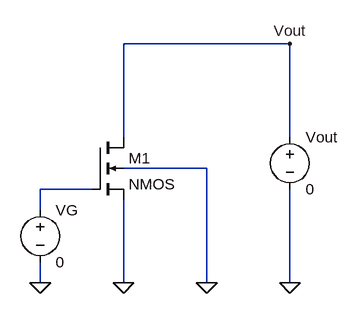
[diagram p0: schematic Chapter03C_01.fig.asc]
Chapter03C_01.fig.asc, the LTspice schematic file:
Version 4
SHEET 1 2940 740
WIRE 112 -64 -144 -64
WIRE -144 80 -144 -64
WIRE 112 80 112 -64
WIRE -16 128 -144 128
WIRE -192 160 -272 160
WIRE -272 192 -272 160
WIRE -272 304 -272 272
WIRE -144 304 -144 176
WIRE -16 304 -16 128
WIRE 112 304 112 160
FLAG -144 304 0
FLAG -16 304 0
FLAG 112 304 0
FLAG 112 -64 Vout
FLAG -272 304 0
SYMBOL nmos4 -192 80 R0
SYMATTR InstName M1
SYMBOL voltage 112 64 R0
SYMATTR InstName Vout
SYMATTR Value 0
SYMBOL voltage -272 176 R0
WINDOW 123 0 0 Left 0
WINDOW 39 0 0 Left 0
SYMATTR InstName VG
SYMATTR Value 0

The netlist it stands for:
* Chapter03C_01.fig.asc
M1 Vout N001 0 0 NMOS
Vout Vout 0 0
VG N001 0 0
.model NMOS NMOS
.model PMOS PMOS
.lib standard.mos
.backanno
.end